# Altium schematic sheet giris_BlockDiagram.SchDoc: Wireless Security Detector
size A3; Date: 29/07/2021; ApprovedBy: Hamit Karataş; CheckedBy: Hamit Karataş; Author: Hamit Karataş; CompanyName: Ytu; DrawnBy: Hamit Karataş; Engineer: Hamit Karatas; Organization: Manta; DocumentNumber: 1; Revision: 00; SheetNumber: 1; SheetTotal: 4; Project: Wireless Security Detector; ENG_APP_DATE: --/--/--; DSN_APP_DATE: --/--/--; CHK_APP_DATE: --/--/--
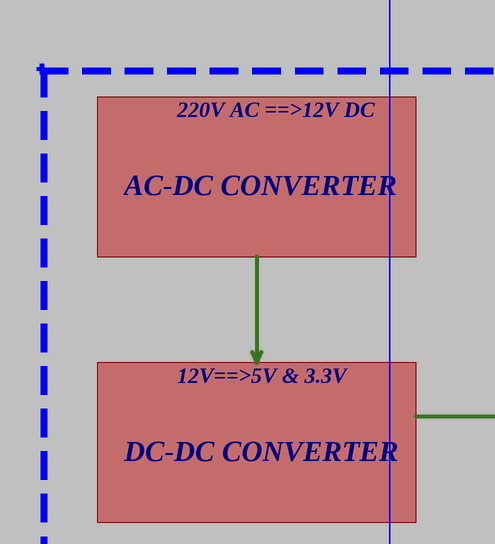
[diagram p0: giris_BlockDiagram.SchDoc, top left]
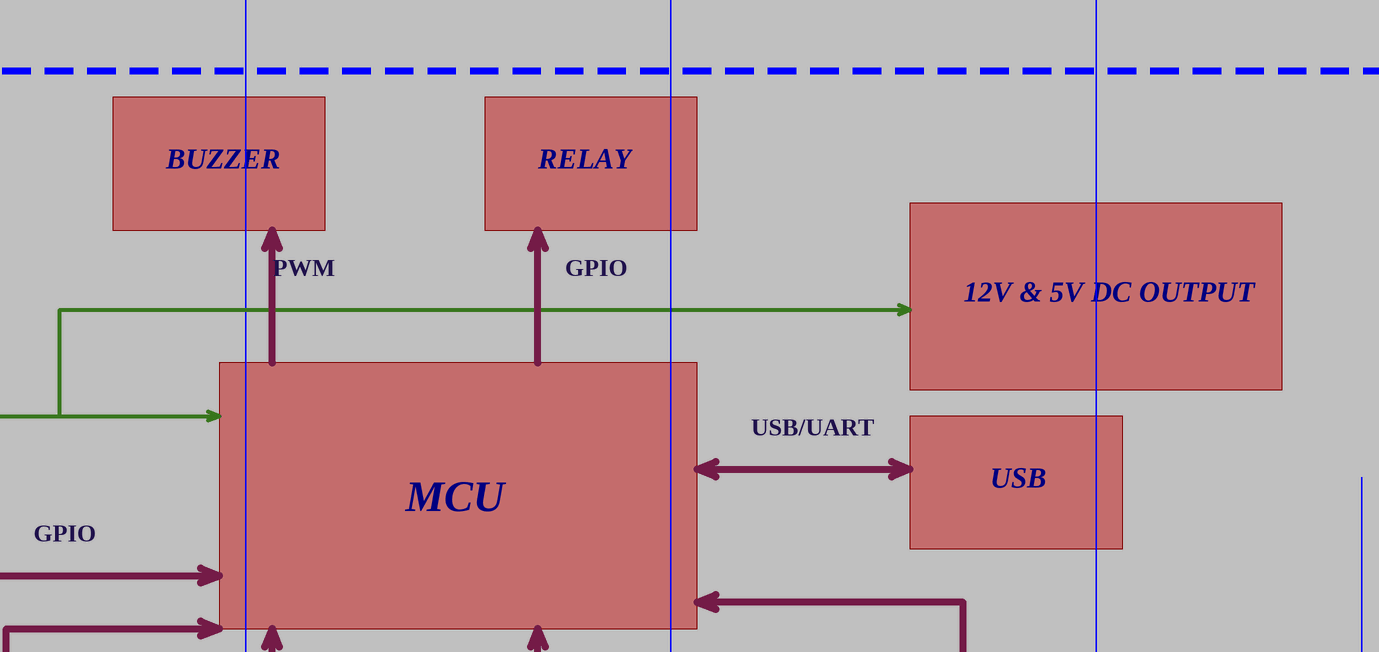
[diagram p1: giris_BlockDiagram.SchDoc, top right]
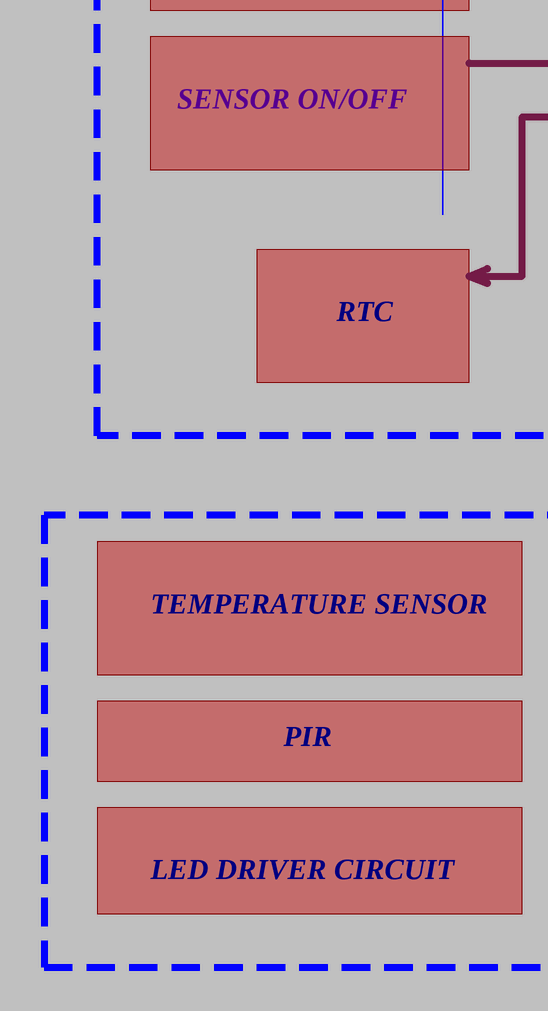
[diagram p2: giris_BlockDiagram.SchDoc, bottom left]
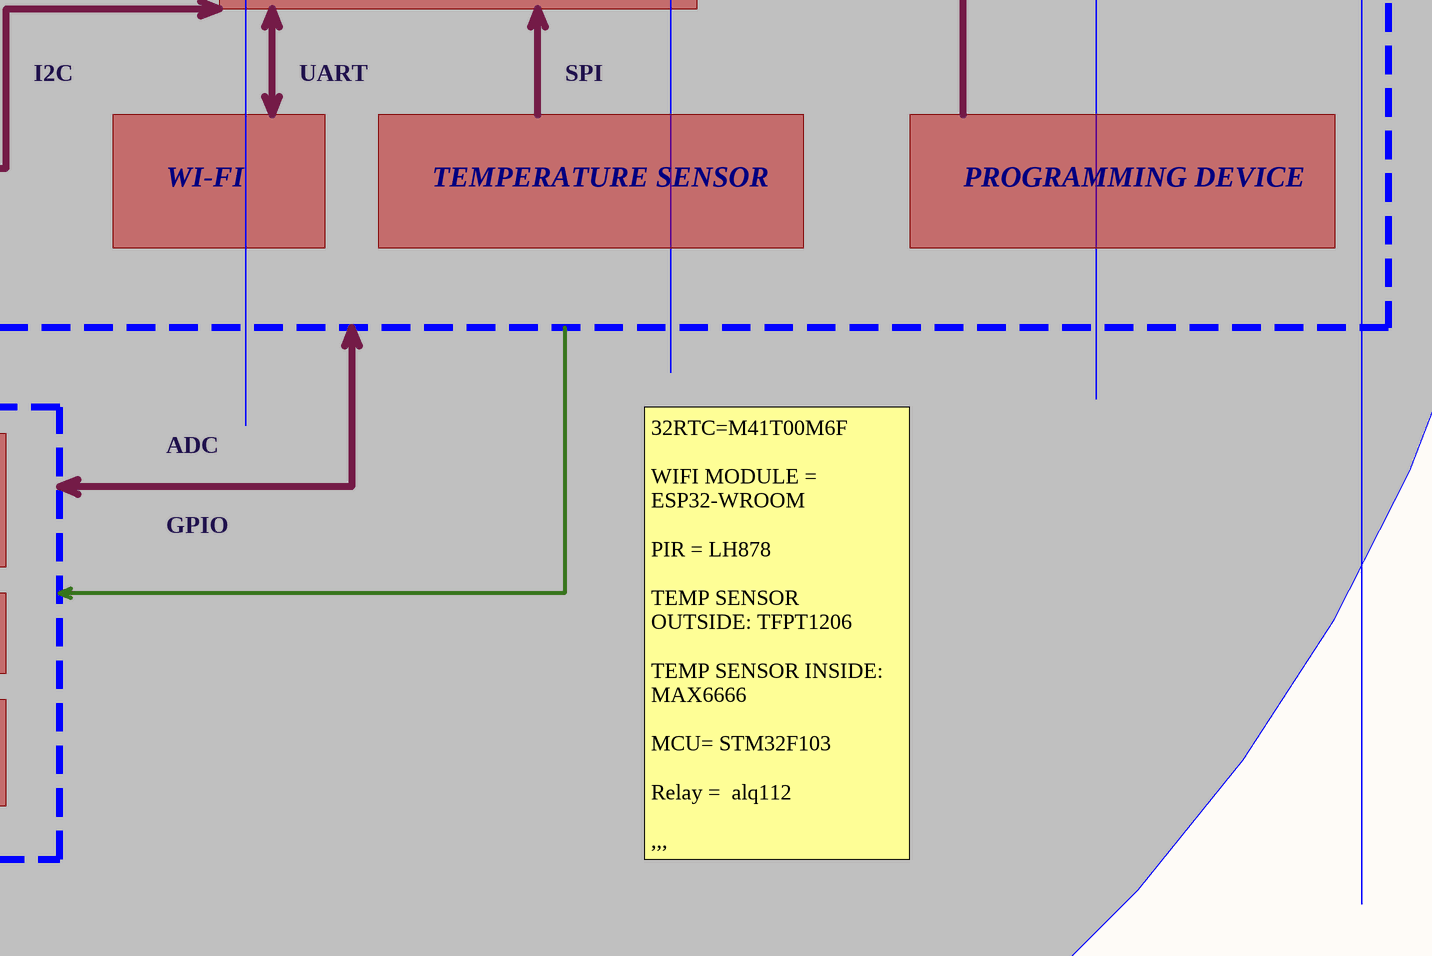
[diagram p3: giris_BlockDiagram.SchDoc, bottom right]

## Notes on the sheet
- 220V AC ==>12V DC
- AC-DC CONVERTER
- BUZZER
- RELAY
- PWM
- GPIO
- 12V & 5V DC OUTPUT
- 12V==>5V & 3.3V
- DC-DC CONVERTER
- USB/UART
- MCU
- USB
- SENSOR ON/OFF
- I2C
- UART
- SPI
- WI-FI
- TEMPERATURE SENSOR
- PROGRAMMING DEVICE
- RTC
- ADC
- PIR
- LED DRIVER CIRCUIT
- 32RTC=M41T00M6F
  WIFI MODULE = ESP32-WROOM
  PIR = LH878
  TEMP SENSOR OUTSIDE: TFPT1206
  TEMP SENSOR INSIDE: MAX6666
  MCU= STM32F103
  Relay =  alq112
  ,,,
- DocumentName
- ProjectName
- Engineer
- Title